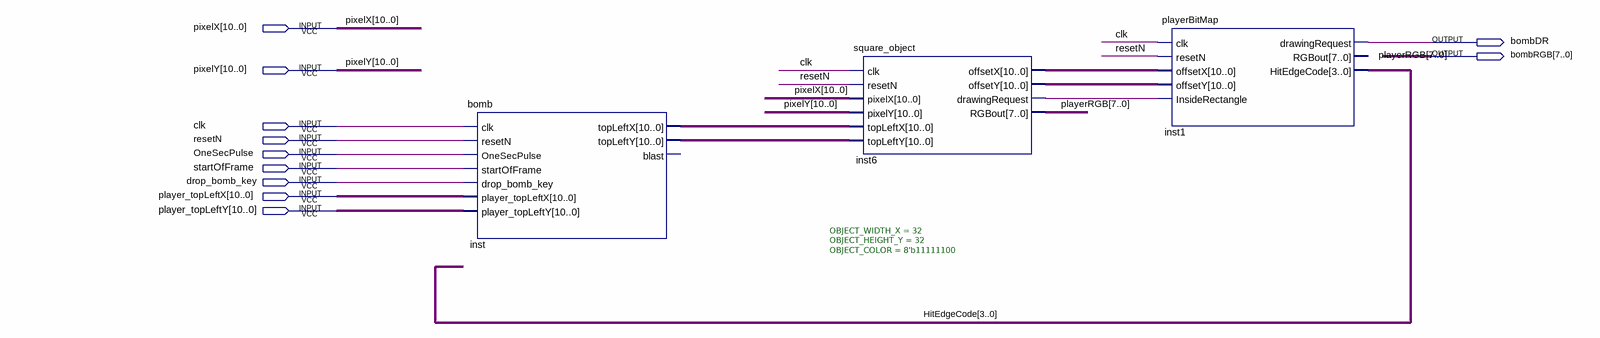
[diagram p0: schematic sheet]
// Quartus schematic Bomb_Block_T.bdf as structural Verilog: 3 symbols, 11 pins
module Bomb_Block_T (
  input  [10:0] pixelX,
  input  [10:0] pixelY,
  input  clk,
  input  resetN,
  input  OneSecPulse,
  input  startOfFrame,
  input  drop_bomb_key,
  input  [10:0] player_topLeftX,
  input  [10:0] player_topLeftY,
  output bombDR,
  output [7:0] bombRGB
);

  wire inst6_drawingrequest;
  wire [3:0] HitEdgeCode;
  wire [10:0] inst6_offsetx, inst6_offsety, inst_topleftx, inst_toplefty;

  bomb inst (
    .clk(clk), .resetN(resetN), .OneSecPulse(OneSecPulse), .startOfFrame(startOfFrame),
    .drop_bomb_key(drop_bomb_key), .player_topLeftX(player_topLeftX), .player_topLeftY(player_topLeftY),
    .topLeftX(inst_topleftx), .topLeftY(inst_toplefty));  // open: blast
  square_object #(.OBJECT_WIDTH_X(32), .OBJECT_HEIGHT_Y(32), .OBJECT_COLOR(8'b11111100)) inst6 (
    .clk(clk), .resetN(resetN), .pixelX(pixelX), .pixelY(pixelY), .topLeftX(inst_topleftx),
    .topLeftY(inst_toplefty), .offsetX(inst6_offsetx), .offsetY(inst6_offsety),
    .drawingRequest(inst6_drawingrequest), .RGBout(bombRGB));
  playerBitMap inst1 (
    .clk(clk), .resetN(resetN), .offsetX(inst6_offsetx), .offsetY(inst6_offsety),
    .InsideRectangle(inst6_drawingrequest), .drawingRequest(bombDR), .HitEdgeCode(HitEdgeCode));  // open: RGBout

  // Other names for the same wires on the sheet: playerRGB[7:0] = bombRGB
endmodule
